# EAGLE design Varmo - Rev A2 (EAGLE 7.6.0)

## Sheet 1 of 3
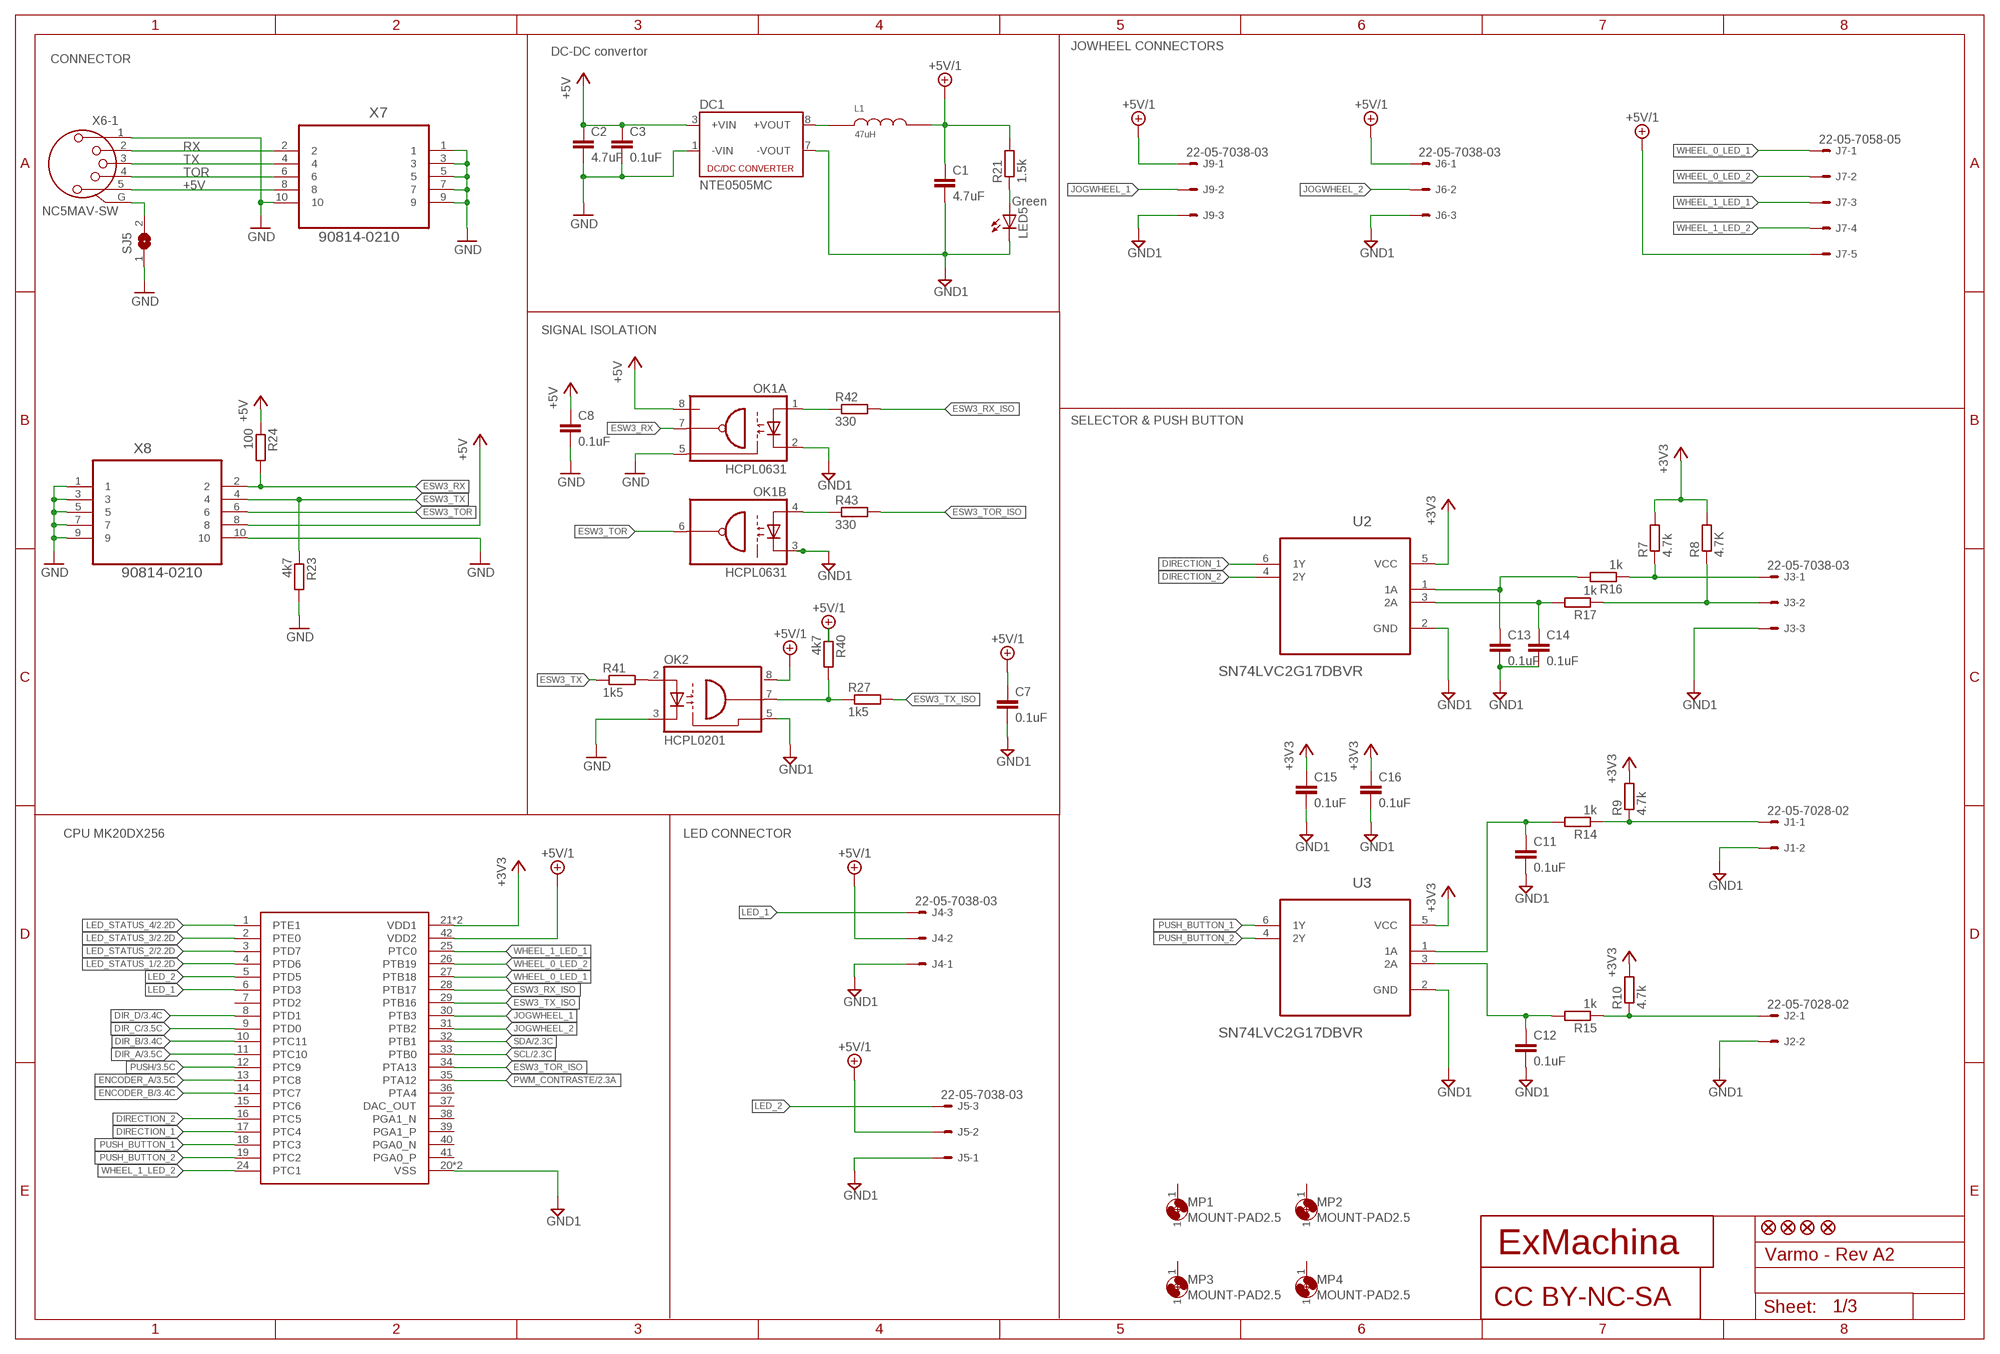
[diagram p0: schematic, sheet 1]

### Parts
C1  4.7uF  C-EUC0603  [C0603]
C2  4.7uF  C-EUC0603  [C0603]
C3  0.1uF  C-EUC0603  [C0603]
C7  0.1uF  C-EUC0603  [C0603]
C8  0.1uF  C-EUC0603  [C0603]
C11  0.1uF  C-EUC0603  [C0603]
C12  0.1uF  C-EUC0603  [C0603]
C13  0.1uF  C-EUC0603  [C0603]
C14  0.1uF  C-EUC0603  [C0603]
C15  0.1uF  C-EUC0603  [C0603]
C16  0.1uF  C-EUC0603  [C0603]
DC1  NTE0505MC  [NTE]
J1  22-05-7028-02  [7395-02]
J2  22-05-7028-02  [7395-02]
J3  22-05-7038-03  [7395-03]
J4  22-05-7038-03  [7395-03]
J5  22-05-7038-03  [7395-03]
J6  22-05-7038-03  [7395-03]
J7  22-05-7058-05  [7395-05]
J9  22-05-7038-03  [7395-03]
JP1  FIDUCIAL1X2  [FIDUCIAL-1X2]
JP2  FIDUCIAL1X2  [FIDUCIAL-1X2]
JP3  FIDUCIAL1X2  [FIDUCIAL-1X2]
JP4  FIDUCIAL1X2  [FIDUCIAL-1X2]
L1  47uH  82473C  [8200]
LED5  Green  LEDCHIP-LED0603  [CHIP-LED0603]
MP1  MOUNT-PAD2.5  [P2.5]
MP2  MOUNT-PAD2.5  [P2.5]
MP3  MOUNT-PAD2.5  [P2.5]
MP4  MOUNT-PAD2.5  [P2.5]
OK1  HCPL0631  [SOIC08]
OK2  HCPL0201  [SOIC08]
R7  4.7k  R-EU_R0603  [R0603]
R8  4.7K  R-EU_R0603  [R0603]
R9  4.7k  R-EU_R0603  [R0603]
R10  4.7k  R-EU_R0603  [R0603]
R14  1k  R-EU_R0603  [R0603]
R15  1k  R-EU_R0603  [R0603]
R16  1k  R-EU_R0603  [R0603]
R17  1k  R-EU_R0603  [R0603]
R21  1.5k  R-EU_R0603  [R0603]
R23  4k7  R-EU_R0603  [R0603]
R24  100  R-EU_R0603  [R0603]
R27  1k5  R-EU_R0603  [R0603]
R40  4k7  R-EU_R0603  [R0603]
R41  1k5  R-EU_R0603  [R0603]
R42  330  R-EU_R0603  [R0603]
R43  330  R-EU_R0603  [R0603]
SJ5  SJ  [SJ]
U2  SN74LVC2G17DBVR  [SOT95P280X145-6N]
U3  SN74LVC2G17DBVR  [SOT95P280X145-6N]
U8  M20DX256  [MK_CUSTOM]
U$1  CC-BY-NC-SA  [CC-BY-NC-SA]
U$6  EXMACHINA-LOGO-NAME  [EXM-LOGO-BASELINE]
X6  NC5MAV-SW  [NC5MAV-SW]
X7  90814-0210  [MOLEX_90814-0210]
X8  90814-0210  [MOLEX_90814-0210]

### Nets
+3V3: C15.1 C16.1 R7.2 R8.2 R9.2 R10.2 U2.5(VCC) U3.5(VCC) U8.21(VDD1) U8.22(VDD1) ; also sheet 2
+5V: C2.1 C3.1 C8.1 DC1.3(+VIN) OK1.8(A:VCC) R24.1 X6.5 X7.8 X8.8
+5V/1: C1.1 C7.1 J4.2 J5.2 J6.1 J7.5 J9.1 L1.2 OK2.8(VCC) R21.2 R40.1 U8.42(VDD2) ; also sheet 2,3
DIR_A: U8.11(PTC10) ; also sheet 3
DIR_B: U8.10(PTC11) ; also sheet 3
DIR_C: U8.9(PTD0) ; also sheet 3
DIR_D: U8.8(PTD1) ; also sheet 3
DIRECTION_1: U2.6(1Y) U8.17(PTC4)
DIRECTION_2: U2.4(2Y) U8.16(PTC5)
ENCODER_A: U8.13(PTC8) ; also sheet 3
ENCODER_B: U8.14(PTC7) ; also sheet 3
ESW3_RX: OK1.7(A:VO) R24.2 X8.2
ESW3_RX_ISO: R42.2 U8.28(PTB17)
ESW3_TOR: OK1.6(B:VO2) X8.6
ESW3_TOR_ISO: R43.2 U8.34(PTA13)
ESW3_TX: R23.1 R41.1 X8.4
ESW3_TX_ISO: R27.2 U8.29(PTB16)
GND: C2.2 C3.2 C8.2 DC1.1(-VIN) OK1.5(A:GND) OK2.3(C) R23.2 SJ5.1 X6.1 X7.1 X7.3 X7.5 X7.7 X7.9 X7.10 X8.1 X8.3 X8.5 X8.7 X8.9 X8.10
GND1: C1.2 C7.2 C11.2 C12.2 C13.2 C14.2 C15.2 C16.2 DC1.7(-VOUT) J1.2 J2.2 J3.3 J4.1 J5.1 J6.3 J9.3 LED5.C OK1.2(A:C1) OK1.3(B:C2) OK2.5(GND) U2.2(GND) U3.2(GND) U8.20(VSS) U8.23(VSS) ; also sheet 2,3
JOGWHEEL_1: J9.2 U8.30(PTB3)
JOGWHEEL_2: J6.2 U8.31(PTB2)
LED_1: J4.3 U8.6(PTD3)
LED_2: J5.3 U8.5(PTD5)
LED_STATUS_1: U8.4(PTD6) ; also sheet 2
LED_STATUS_2: U8.3(PTD7) ; also sheet 2
LED_STATUS_3: U8.2(PTE0) ; also sheet 2
LED_STATUS_4: U8.1(PTE1) ; also sheet 2
N$1: DC1.8(+VOUT) L1.1
N$6: J2.1 R10.1 R15.1
N$7: J1.1 R9.1 R14.1
N$8: J3.1 R7.1 R16.1
N$9: J3.2 R8.1 R17.1
N$10: C13.1 R16.2 U2.1(1A)
N$11: C14.1 R17.2 U2.3(2A)
N$12: C12.1 R15.2 U3.3(2A)
N$13: C11.1 R14.2 U3.1(1A)
N$15: OK2.7(VO) R27.1 R40.2
N$23: SJ5.2 X6.G(-1:G)
N$35: LED5.A R21.1
N$37: OK1.1(A:A1) R42.1
N$38: OK1.4(B:A2) R43.1
N$39: OK2.2(A) R41.2
PUSH: U8.12(PTC9) ; also sheet 3
PUSH_BUTTON_1: U3.6(1Y) U8.18(PTC3)
PUSH_BUTTON_2: U3.4(2Y) U8.19(PTC2)
PWM_CONTRASTE: U8.35(PTA12) ; also sheet 2
RX: X6.2 X7.2
SCL: U8.33(PTB0) ; also sheet 2
SDA: U8.32(PTB1) ; also sheet 2
TOR: X6.4 X7.6
TX: X6.3 X7.4
WHEEL_0_LED_1: J7.1 U8.27(PTB18)
WHEEL_0_LED_2: J7.2 U8.26(PTB19)
WHEEL_1_LED_1: J7.3 U8.25(PTC0)
WHEEL_1_LED_2: J7.4 U8.24(PTC1)
Unconnected: MP1.1 MP2.1 MP3.1 MP4.1 U8.7(PTD2) U8.15(PTC6) U8.36(PTA4) U8.37(DAC_OUT) U8.38(PGA1_N) U8.39(PGA1_P) U8.40(PGA0_N) U8.41(PGA0_P) X6.N(-2:N) X6.NC(-2:NC) X6.NO(-2:NO)

### Notes on the sheet
- JOWHEEL CONNECTORS
- DC-DC convertor
- CONNECTOR
- SIGNAL ISOLATION
- SELECTOR & PUSH BUTTON
- CPU MK20DX256 | LED CONNECTOR

## Sheet 2 of 3: LCD Screen and LED panel
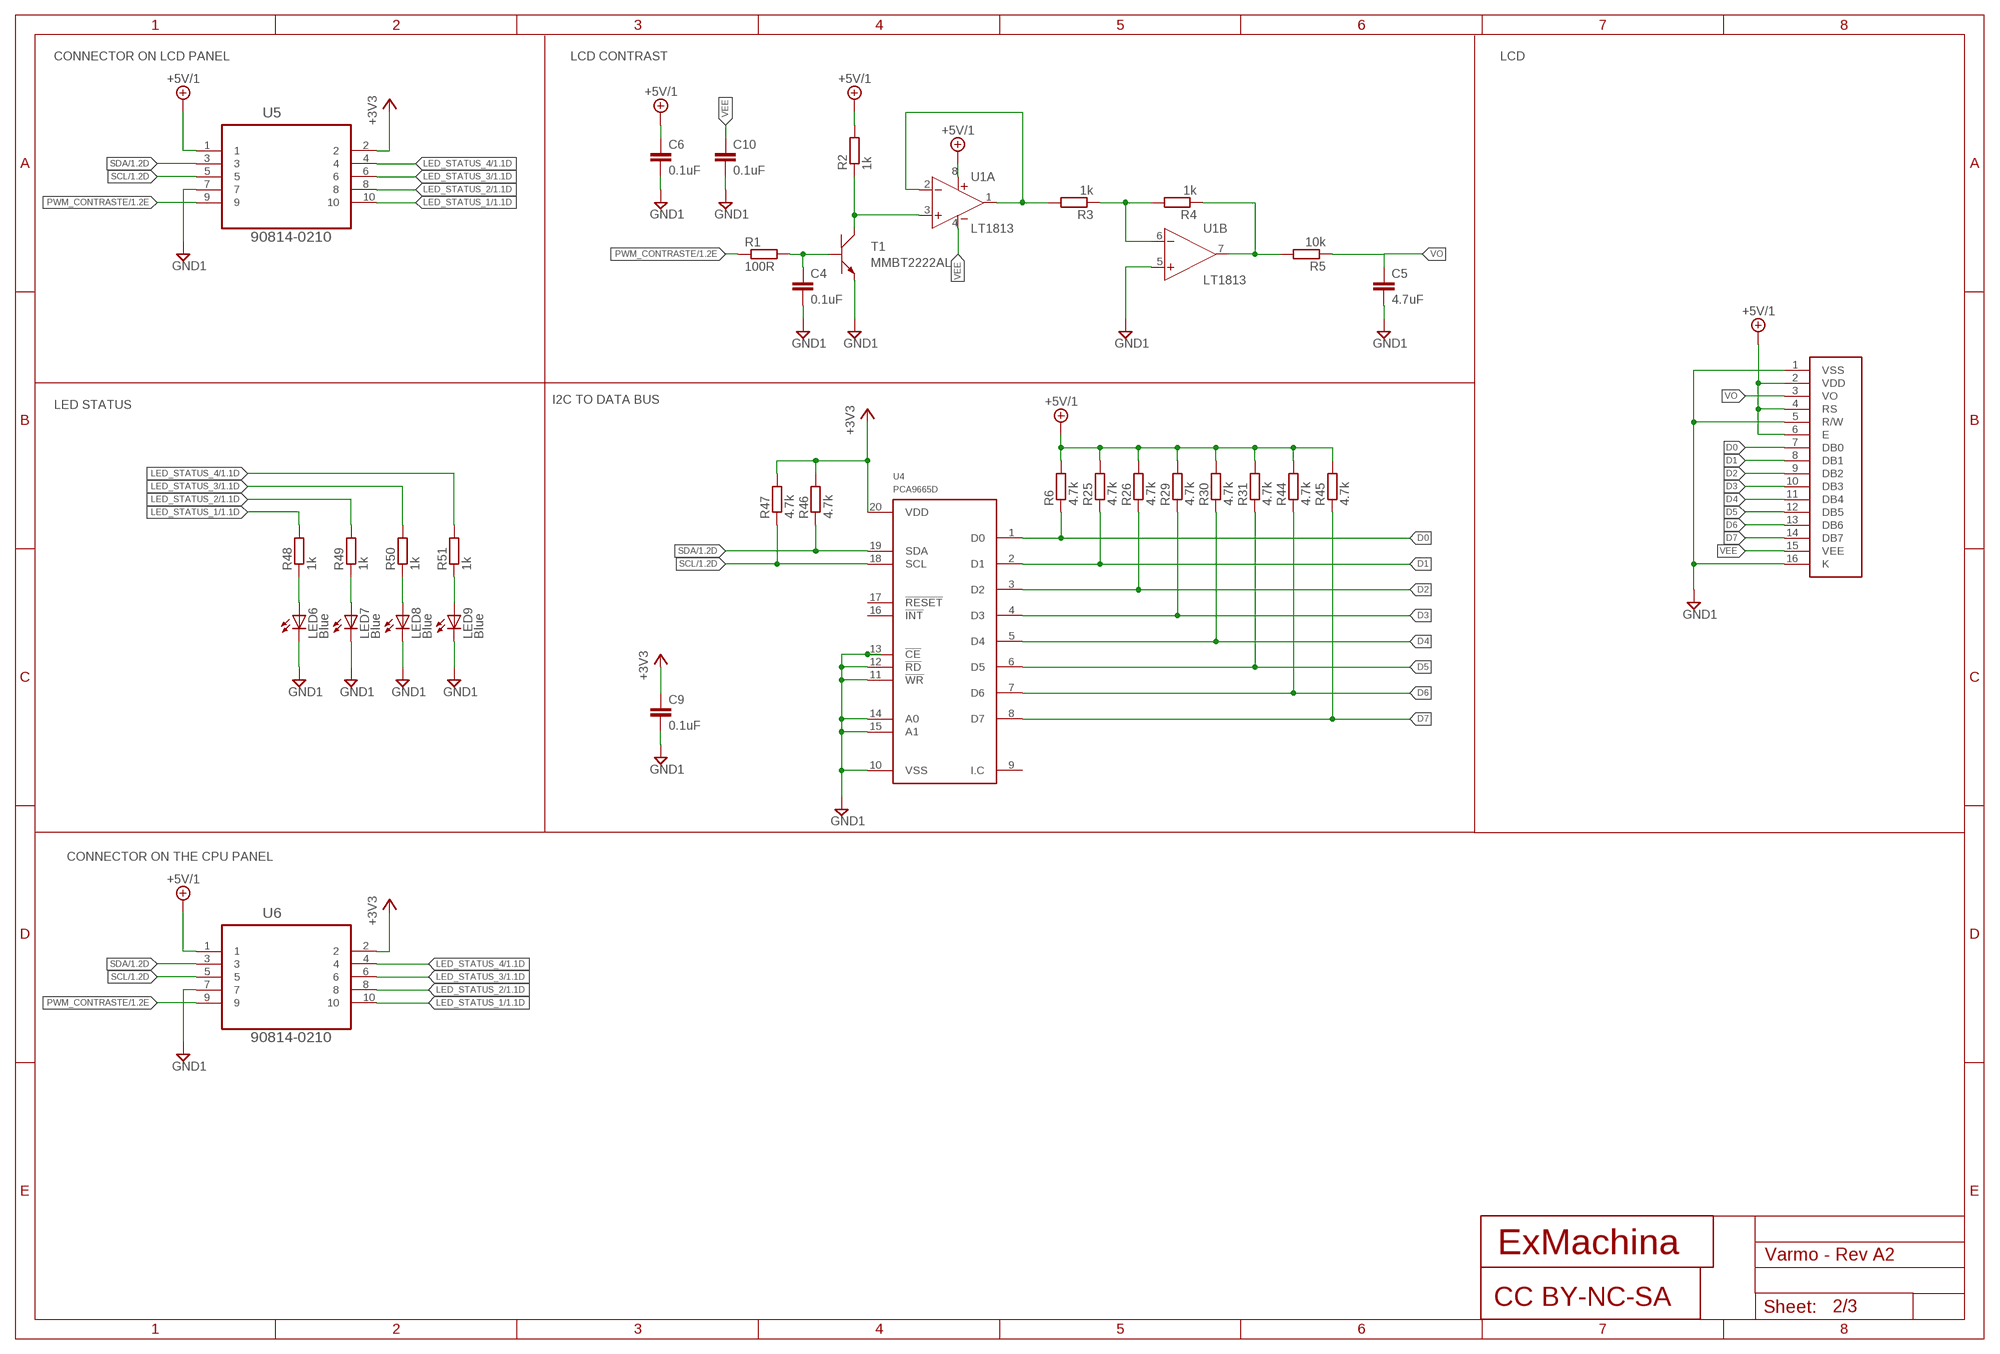
[diagram p1: schematic, sheet 2]

### Parts
C4  0.1uF  C-EUC0603  [C0603]
C5  4.7uF  C-EUC0603  [C0603]
C6  0.1uF  C-EUC0603  [C0603]
C9  0.1uF  C-EUC0603  [C0603]
C10  0.1uF  C-EUC0603  [C0603]
LCD1  MC41605A12W  [CONNECTOR]
LED6  Blue  LEDCHIP-LED0603  [CHIP-LED0603]
LED7  Blue  LEDCHIP-LED0603  [CHIP-LED0603]
LED8  Blue  LEDCHIP-LED0603  [CHIP-LED0603]
LED9  Blue  LEDCHIP-LED0603  [CHIP-LED0603]
R1  100R  R-EU_R0603  [R0603]
R2  1k  R-EU_R0603  [R0603]
R3  1k  R-EU_R0603  [R0603]
R4  1k  R-EU_R0603  [R0603]
R5  10k  R-EU_R0603  [R0603]
R6  4.7k  R-EU_R0603  [R0603]
R25  4.7k  R-EU_R0603  [R0603]
R26  4.7k  R-EU_R0603  [R0603]
R29  4.7k  R-EU_R0603  [R0603]
R30  4.7k  R-EU_R0603  [R0603]
R31  4.7k  R-EU_R0603  [R0603]
R44  4.7k  R-EU_R0603  [R0603]
R45  4.7k  R-EU_R0603  [R0603]
R46  4.7k  R-EU_R0603  [R0603]
R47  4.7k  R-EU_R0603  [R0603]
R48  1k  R-EU_R0603  [R0603]
R49  1k  R-EU_R0603  [R0603]
R50  1k  R-EU_R0603  [R0603]
R51  1k  R-EU_R0603  [R0603]
T1  MMBT2222AL  [SOT−23]
U1  LT1813  [S8]
U4  PCA9665D  [SOT163-1]
U5  90814-0210  [MOLEX_90814-0210]
U6  90814-0210  [MOLEX_90814-0210]
U$5  CC-BY-NC-SA  [CC-BY-NC-SA]
U$7  EXMACHINA-LOGO-NAME  [EXM-LOGO-BASELINE]

### Nets
+3V3: C9.1 R46.2 R47.2 U4.20(VDD) U5.2 U6.2 ; also sheet 1
+5V/1: C6.1 LCD1.2(VDD) LCD1.4(RS) LCD1.6(E) R2.2 R6.2 R25.2 R26.2 R29.2 R30.2 R31.2 R44.2 R45.2 U1.8(A:V+) U5.1 U6.1 ; also sheet 1,3
D0: LCD1.7(DB0) R6.1 U4.1(D0)
D1: LCD1.8(DB1) R25.1 U4.2(D1)
D2: LCD1.9(DB2) R26.1 U4.3(D2)
D3: LCD1.10(DB3) R29.1 U4.4(D3)
D4: LCD1.11(DB4) R30.1 U4.5(D4)
D5: LCD1.12(DB5) R31.1 U4.6(D5)
D6: LCD1.13(DB6) R44.1 U4.7(D6)
D7: LCD1.14(DB7) R45.1 U4.8(D7)
GND1: C4.2 C5.2 C6.2 C9.2 C10.2 LCD1.1(VSS) LCD1.5(R/W) LCD1.16(K) LED6.C LED7.C LED8.C LED9.C T1.2(E) U1.5(B:IN+) U4.10(VSS) U4.11(!WR) U4.12(!RD) U4.13(!CE) U4.14(A0) U4.15(A1) U5.7 U6.7 ; also sheet 1,3
LED_STATUS_1: R48.2 U5.10 U6.10 ; also sheet 1
LED_STATUS_2: R49.2 U5.8 U6.8 ; also sheet 1
LED_STATUS_3: R50.2 U5.6 U6.6 ; also sheet 1
LED_STATUS_4: R51.2 U5.4 U6.4 ; also sheet 1
N$2: C4.1 R1.2 T1.1(B)
N$3: R2.1 T1.3(C) U1.3(A:IN+)
N$4: LED6.A R48.1
N$5: R3.2 U1.1(A:OUT) U1.2(A:IN-)
N$14: R3.1 R4.2 U1.6(B:IN-)
N$17: R4.1 R5.2 U1.7(B:OUT)
N$22: LED7.A R49.1
N$24: LED8.A R50.1
N$29: LED9.A R51.1
PWM_CONTRASTE: R1.1 U5.9 U6.9 ; also sheet 1
SCL: R47.1 U4.18(SCL) U5.5 U6.5 ; also sheet 1
SDA: R46.1 U4.19(SDA) U5.3 U6.3 ; also sheet 1
VEE: C10.1 LCD1.15(VEE) U1.4(A:V-)
VO: C5.1 LCD1.3(VO) R5.1
Unconnected: U4.9(I.C) U4.16(!INT) U4.17(!RESET)

### Notes on the sheet
- CONNECTOR ON LCD PANEL | LCD CONTRAST | LCD
- I2C TO DATA BUS
- LED STATUS
- CONNECTOR ON THE CPU PANEL

## Sheet 3 of 3: ENCODER AND JOYSTICK
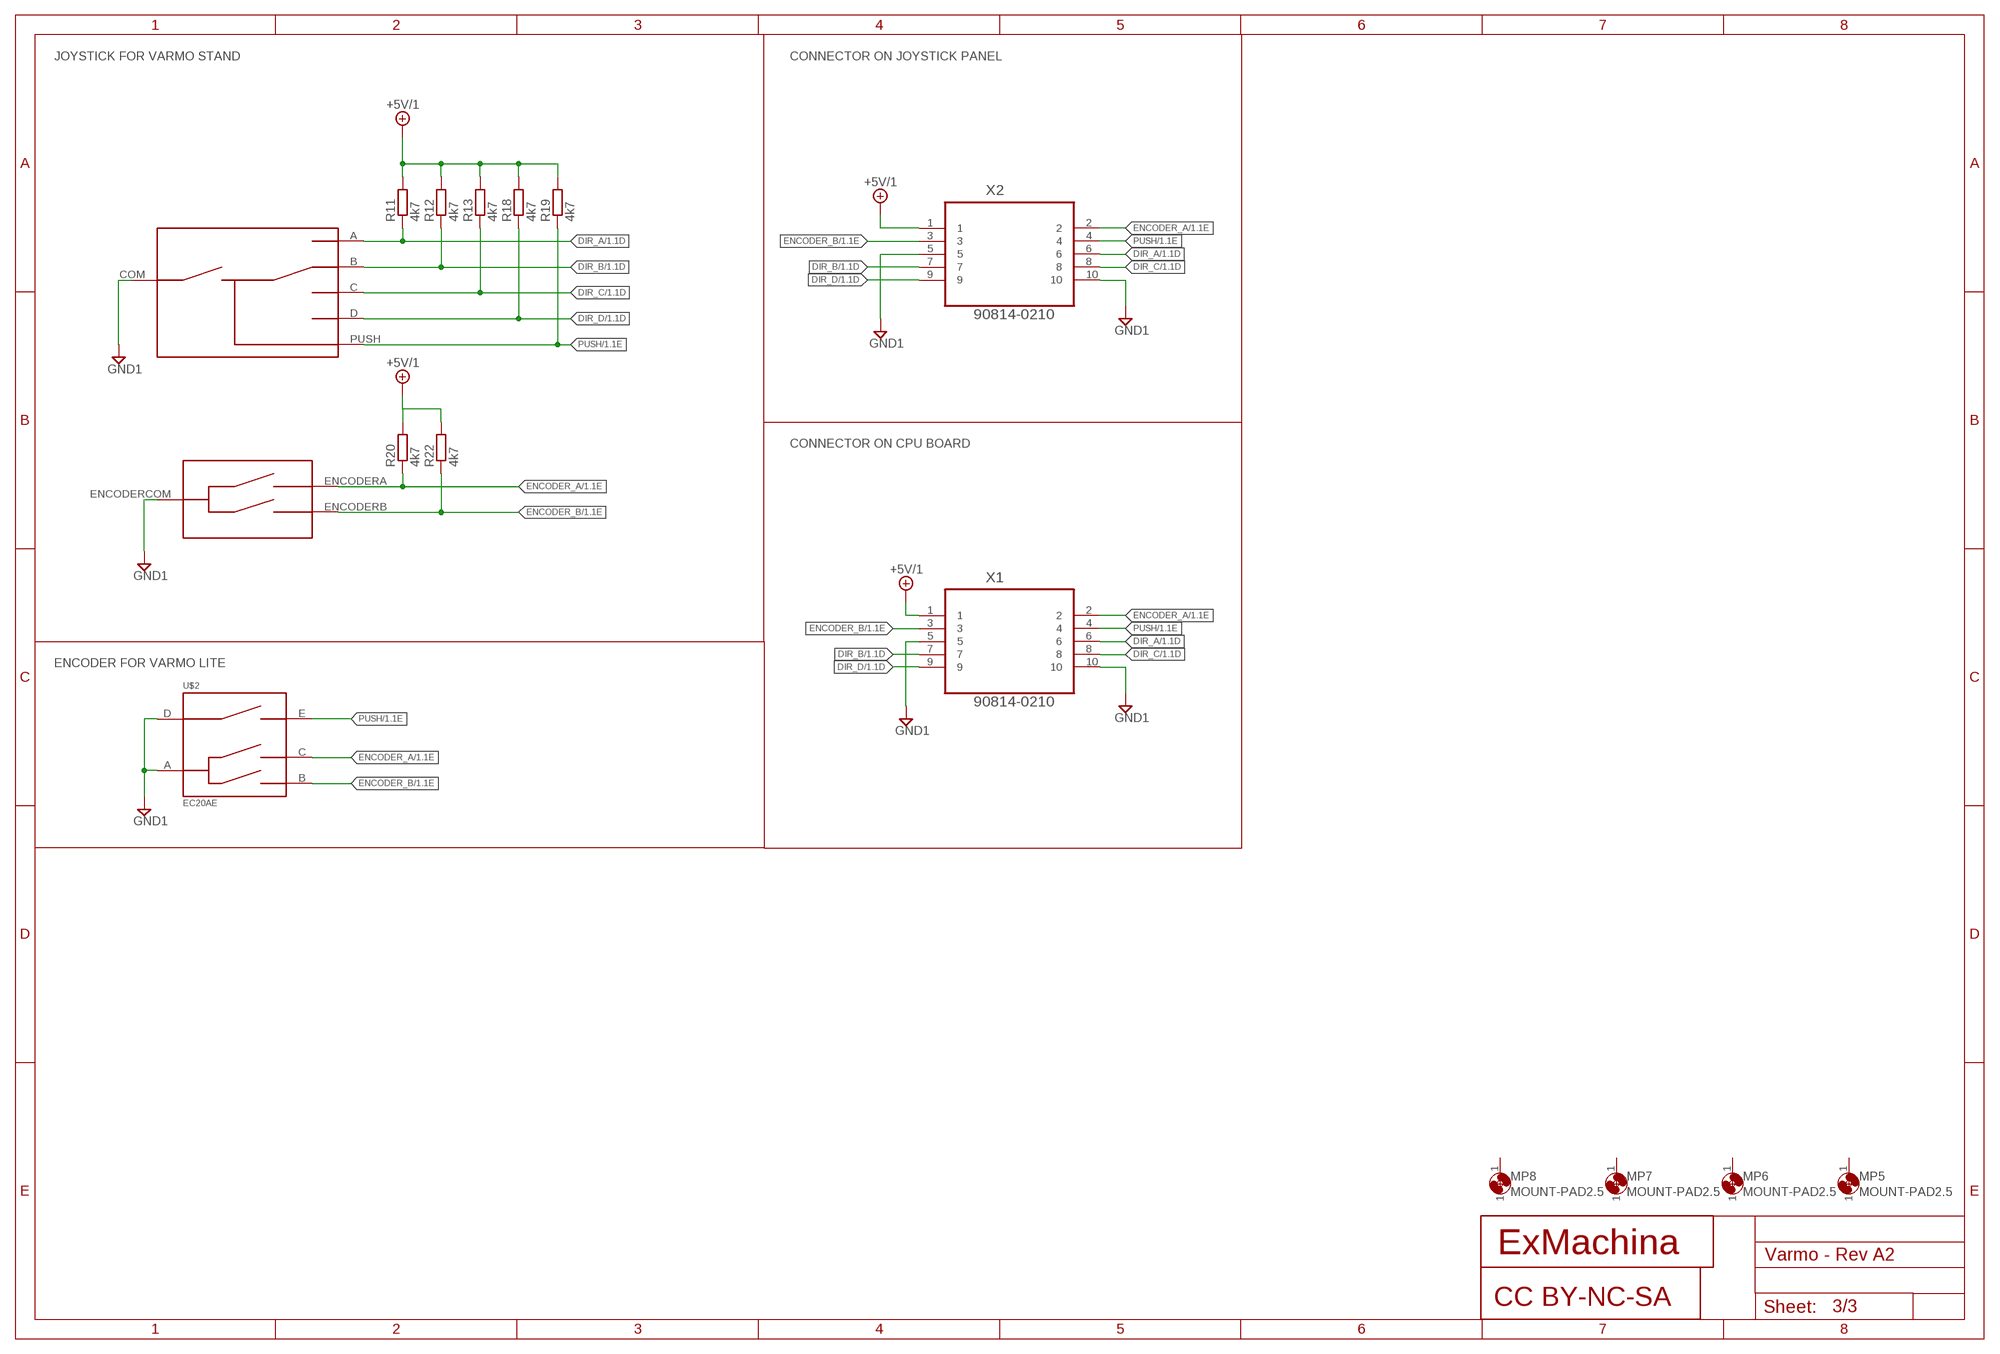
[diagram p2: schematic, sheet 3]

### Parts
ENC1  RKJXTF42001  [RKJXT1F]
MP5  MOUNT-PAD2.5  [P2.5]
MP6  MOUNT-PAD2.5  [P2.5]
MP7  MOUNT-PAD2.5  [P2.5]
MP8  MOUNT-PAD2.5  [P2.5]
R11  4k7  R-EU_R0603  [R0603]
R12  4k7  R-EU_R0603  [R0603]
R13  4k7  R-EU_R0603  [R0603]
R18  4k7  R-EU_R0603  [R0603]
R19  4k7  R-EU_R0603  [R0603]
R20  4k7  R-EU_R0603  [R0603]
R22  4k7  R-EU_R0603  [R0603]
U$2  EC20AE  [EC20A]
U$3  EXMACHINA-LOGO-NAME  [EXM-LOGO-BASELINE]
U$4  CC-BY-NC-SA  [CC-BY-NC-SA]
X1  90814-0210  [MOLEX_90814-0210]
X2  90814-0210  [MOLEX_90814-0210]

### Nets
+5V/1: R11.2 R12.2 R13.2 R18.2 R19.2 R20.2 R22.2 X1.1 X2.1 ; also sheet 1,2
DIR_A: ENC1.A R11.1 X1.6 X2.6 ; also sheet 1
DIR_B: ENC1.B R12.1 X1.7 X2.7 ; also sheet 1
DIR_C: ENC1.C R13.1 X1.8 X2.8 ; also sheet 1
DIR_D: ENC1.D R18.1 X1.9 X2.9 ; also sheet 1
ENCODER_A: ENC1.ENCODERA(A) R20.1 U$2.C(ENCODER_A) X1.2 X2.2 ; also sheet 1
ENCODER_B: ENC1.ENCODERB(B) R22.1 U$2.B(ENCODER_B) X1.3 X2.3 ; also sheet 1
GND1: ENC1.COM ENC1.ENCODERCOM(COM) U$2.A(COM) U$2.D(COM_PUSH) X1.5 X1.10 X2.5 X2.10 ; also sheet 1,2
PUSH: ENC1.PUSH R19.1 U$2.E(PUSH) X1.4 X2.4 ; also sheet 1
Unconnected: MP5.1 MP6.1 MP7.1 MP8.1

### Notes on the sheet
- JOYSTICK FOR VARMO STAND | CONNECTOR ON JOYSTICK PANEL
- CONNECTOR ON CPU BOARD
- ENCODER FOR VARMO LITE

## Library data of the parts
C1 C2 = rcl:C-EU: CAPACITOR, European symbol; MPN: MC0603X475K100CT; OC_NEWARK: 06X6198
C3 C7 C8 C11-C16 = rcl:C-EU: CAPACITOR, European symbol; MPN: MC0603B104K160CT; OC_NEWARK: 06R4923
C4-C6 C9 C10 = rcl:C-EU: CAPACITOR, European symbol
DC1 = dc-dc-converter:NTE; MF: C & D TECHNOLOGIES, INC; MPN: NTE0505MC; OC_NEWARK: 61K3399
ENC1 = encoder:RKJXTF: 4-directional Stick Switch (with Encoder + Center-push Function)
J1 J2 = con-molex:22-?-02: CONNECTOR wire to board 2.54 mm (.1 inch) pitch header; OC_FARNELL: 9731601; OC_NEWARK: unknown
J3-J6 J9 = con-molex:22-?-03: CONNECTOR wire to board 2.54 mm (.1 inch) pitch header; OC_FARNELL: unknown; OC_NEWARK: unknown
J7 = con-molex:22-?-05: CONNECTOR wire to board 2.54 mm (.1 inch) pitch header; OC_FARNELL: unknown; OC_NEWARK: unknown
JP1-JP4 = SparkFun:FIDUCIAL: Fiducial Alignment Points Various fiducial points for machine vision alignment.
L1 = murata-inductance:82473C; MPN: 82473C; OC_NEWARK: 40M7122
LCD1 = midas:MC41605A12W
LED5 = led:LED: LED OSRAM: - CHIPLED LG R971, LG N971, LY N971, LG Q971, LY Q971, LO R971, LY R971 LH N974, LH R974 LS Q976, LO Q976, LY Q976 LO Q996 - Hyper CHIPLED LW Q18S LB Q993, LB Q99A, LB R99A - SideLED LS A670, LO A670, LY A670, LG A670, LP A670 LB A673, LV A673, LT A673, LW A673 LH A674 LY A675 LS A676, LA A676, LO A676, LY A676, LW A676 LS A679, LY A679, LG A679 - Hyper Micro SIDELED® LS Y876, LA Y876, LO Y876, LY Y876 LT Y87S - SmartLED LW L88C, LW L88S LB L89C, LB L89S, LG L890 LS L89K, LO L89K, LY L89K LS L896, LA L896, LO L896, LY L896 - TOPLED LS T670, LO T670, LY T670, LG T670, LP T670 LSG T670, LSP T670, LSY T670, LOP T670, LYG T670 LG T671, LOG T671, LSG T671 LB T673, LV T673, LT T673, LW T673 LH T674 LS T676, LA T676, LO T676, LY T676, LB T676, LH T676, LSB T676, LW T676 LB T67C, LV T67C, LT T67C, LS T67K, LO T67K, LY T67K, LW E67C LS E67B, LA E67B, LO E67B, LY E67B, LB E67C, LV E67C, LT E67C LW T67C LS T679, LY T679, LG T679 LS T770, LO T770, LY T770, LG T770, LP T770 LB T773, LV T773, LT T773, LW T773 LH T774 LS E675, LA E675, LY E675, LS T675 LS T776, LA T776, LO T776, LY T776, LB T776 LHGB T686 LT T68C, LB T68C - Hyper Mini TOPLED® LB M676 - Mini TOPLED Santana® LG M470 LS M47K, LO M47K, LY M47K Source: http://www.osram.convergy.de LUXEON: - LUMILED® LXK2-PW12-R00, LXK2-PW12-S00, LXK2-PW14-U00, LXK2-PW14-V00 LXK2-PM12-R00, LXK2-PM12-S00, LXK2-PM14-U00 LXK2-PE12-Q00, LXK2-PE12-R00, LXK2-PE12-S00, LXK2-PE14-T00, LXK2-PE14-U00 LXK2-PB12-K00, LXK2-PB12-L00, LXK2-PB12-M00, LXK2-PB14-N00, LXK2-PB14-P00, LXK2-PB14-Q00 LXK2-PR12-L00, LXK2-PR12-M00, LXK2-PR14-Q00, LXK2-PR14-R00 LXK2-PD12-Q00, LXK2-PD12-R00, LXK2-PD12-S00 LXK2-PH12-R00, LXK2-PH12-S00 LXK2-PL12-P00, LXK2-PL12-Q00, LXK2-PL12-R00 Source: www.luxeon.com KINGBRIGHT: KA-3528ASYC Source: www.kingbright.com; MPN: OVS-0604; OC_NEWARK: 15R2206
LED6-LED9 = led:LED: LED OSRAM: - CHIPLED LG R971, LG N971, LY N971, LG Q971, LY Q971, LO R971, LY R971 LH N974, LH R974 LS Q976, LO Q976, LY Q976 LO Q996 - Hyper CHIPLED LW Q18S LB Q993, LB Q99A, LB R99A - SideLED LS A670, LO A670, LY A670, LG A670, LP A670 LB A673, LV A673, LT A673, LW A673 LH A674 LY A675 LS A676, LA A676, LO A676, LY A676, LW A676 LS A679, LY A679, LG A679 - Hyper Micro SIDELED® LS Y876, LA Y876, LO Y876, LY Y876 LT Y87S - SmartLED LW L88C, LW L88S LB L89C, LB L89S, LG L890 LS L89K, LO L89K, LY L89K LS L896, LA L896, LO L896, LY L896 - TOPLED LS T670, LO T670, LY T670, LG T670, LP T670 LSG T670, LSP T670, LSY T670, LOP T670, LYG T670 LG T671, LOG T671, LSG T671 LB T673, LV T673, LT T673, LW T673 LH T674 LS T676, LA T676, LO T676, LY T676, LB T676, LH T676, LSB T676, LW T676 LB T67C, LV T67C, LT T67C, LS T67K, LO T67K, LY T67K, LW E67C LS E67B, LA E67B, LO E67B, LY E67B, LB E67C, LV E67C, LT E67C LW T67C LS T679, LY T679, LG T679 LS T770, LO T770, LY T770, LG T770, LP T770 LB T773, LV T773, LT T773, LW T773 LH T774 LS E675, LA E675, LY E675, LS T675 LS T776, LA T776, LO T776, LY T776, LB T776 LHGB T686 LT T68C, LB T68C - Hyper Mini TOPLED® LB M676 - Mini TOPLED Santana® LG M470 LS M47K, LO M47K, LY M47K Source: http://www.osram.convergy.de LUXEON: - LUMILED® LXK2-PW12-R00, LXK2-PW12-S00, LXK2-PW14-U00, LXK2-PW14-V00 LXK2-PM12-R00, LXK2-PM12-S00, LXK2-PM14-U00 LXK2-PE12-Q00, LXK2-PE12-R00, LXK2-PE12-S00, LXK2-PE14-T00, LXK2-PE14-U00 LXK2-PB12-K00, LXK2-PB12-L00, LXK2-PB12-M00, LXK2-PB14-N00, LXK2-PB14-P00, LXK2-PB14-Q00 LXK2-PR12-L00, LXK2-PR12-M00, LXK2-PR14-Q00, LXK2-PR14-R00 LXK2-PD12-Q00, LXK2-PD12-R00, LXK2-PD12-S00 LXK2-PH12-R00, LXK2-PH12-S00 LXK2-PL12-P00, LXK2-PL12-Q00, LXK2-PL12-R00 Source: www.luxeon.com KINGBRIGHT: KA-3528ASYC Source: www.kingbright.com
MP1-MP8 = holes:MOUNT-PAD: MOUNTING HOLE with drill center marker
OK1 = optocoupler:HCPL0631
OK2 = optocoupler:HCPL0201
R1-R6 R25 R26 R29-R31 R44-R51 = rcl:R-EU_: RESISTOR, European symbol
R7-R10 R14-R17 = rcl:R-EU_: RESISTOR, European symbol; MPN: MCMR06X4701FTL; OC_NEWARK: 86T3649
R11-R13 R18-R20 R22-R24 R27 R40-R43 = rcl:R-EU_: RESISTOR, European symbol; MPN: MCMR06X000 PTL; OC_NEWARK: 86T3500
R21 = rcl:R-EU_: RESISTOR, European symbol; MPN: MCMR06X1501FTL; OC_NEWARK: 86T3542
SJ5 = jumper:SJ: SMD solder JUMPER; OC_NEWARK: unknown
T1 = transistor:MMBT2222AL: General Purpose Transistors
U1 = lineartechnology:LT1813: Dual AOP 3mA, 100MHz, 750V/us
U2 U3 = ti:SN74LVC2G17DBVR: DUAL SCHMITT-TRIGGER BUFFER; MF: TEXAS INSTRUMENTS; MPN: SN74LVC2G17DBVR; OC_FARNELL: 1470776; OC_NEWARK: 76C4207; PACKAGE: SOT-23-6; SUPPLIER: Texas Instruments
U4 = NXP:PCA9665D
U5 U6 X1 X2 X7 X8 = Molex_By_element14_Batch_1:90814-0210: CONN HEADER 10POS 1.27MM SMD TIN; MPN: 90814-0210; OC_FARNELL: 1757026; OC_NEWARK: 34R6217; PACKAGE: CONN-10POS; SUPPLIER: Molex
U8 = custom:M20DX256
U$1 U$4 U$5 = cc-by-sa:CC-BY-NC-SA
U$2 = encoder:EC20A
U$3 U$6 U$7 = exmachina:EXMACHINA-LOGO
X6 = con-neutrik_ag:NC5?-SW: Neutrik Audio Connector XLR SERIES Stereo 1/4" jack Source: www.neutrik.com/; MPN: NC5MAV-SW; OC_FARNELL: unknown; OC_NEWARK: 31M5714

## Net classes
0 default: width 0.178 mm, drill 0.35 mm
1 power: width 0.406 mm, drill 0.013 mm

## Board
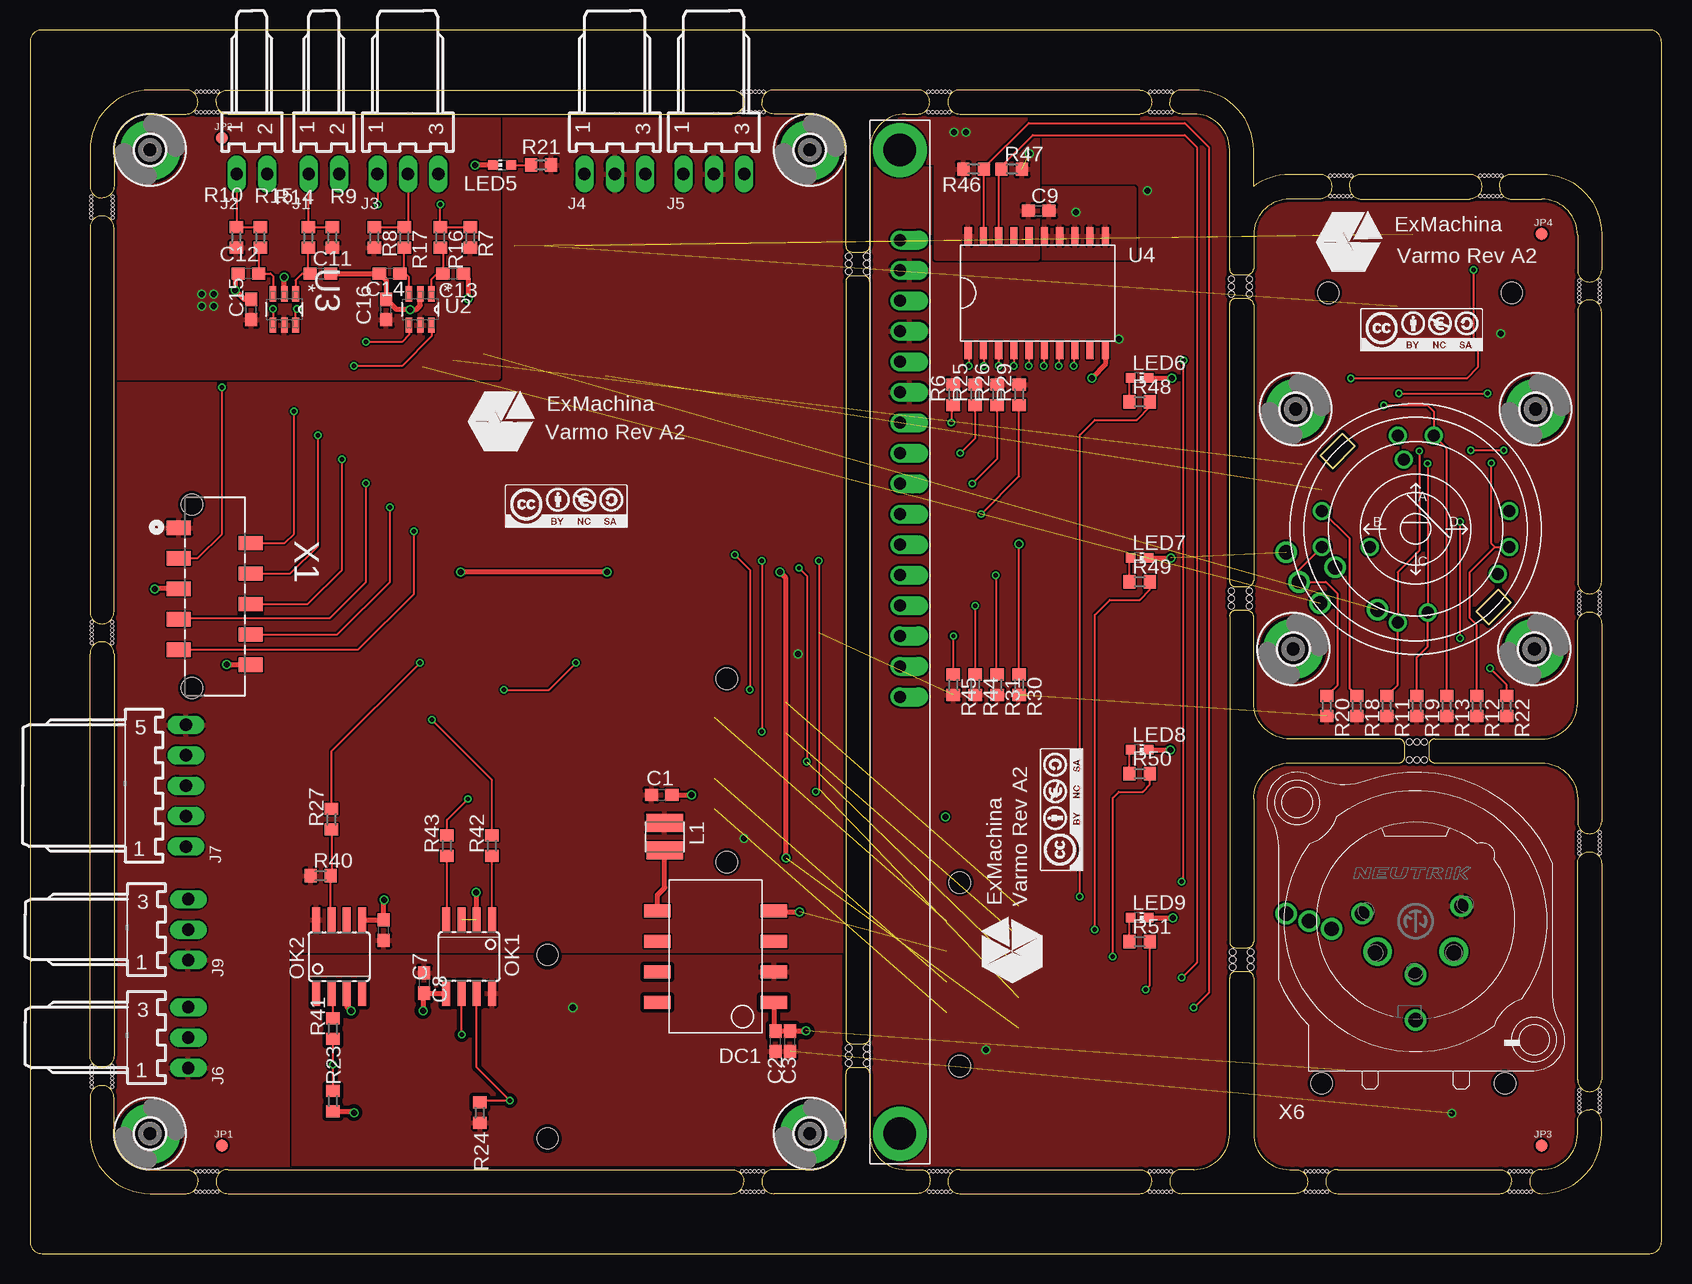
[diagram p3: board, top side]
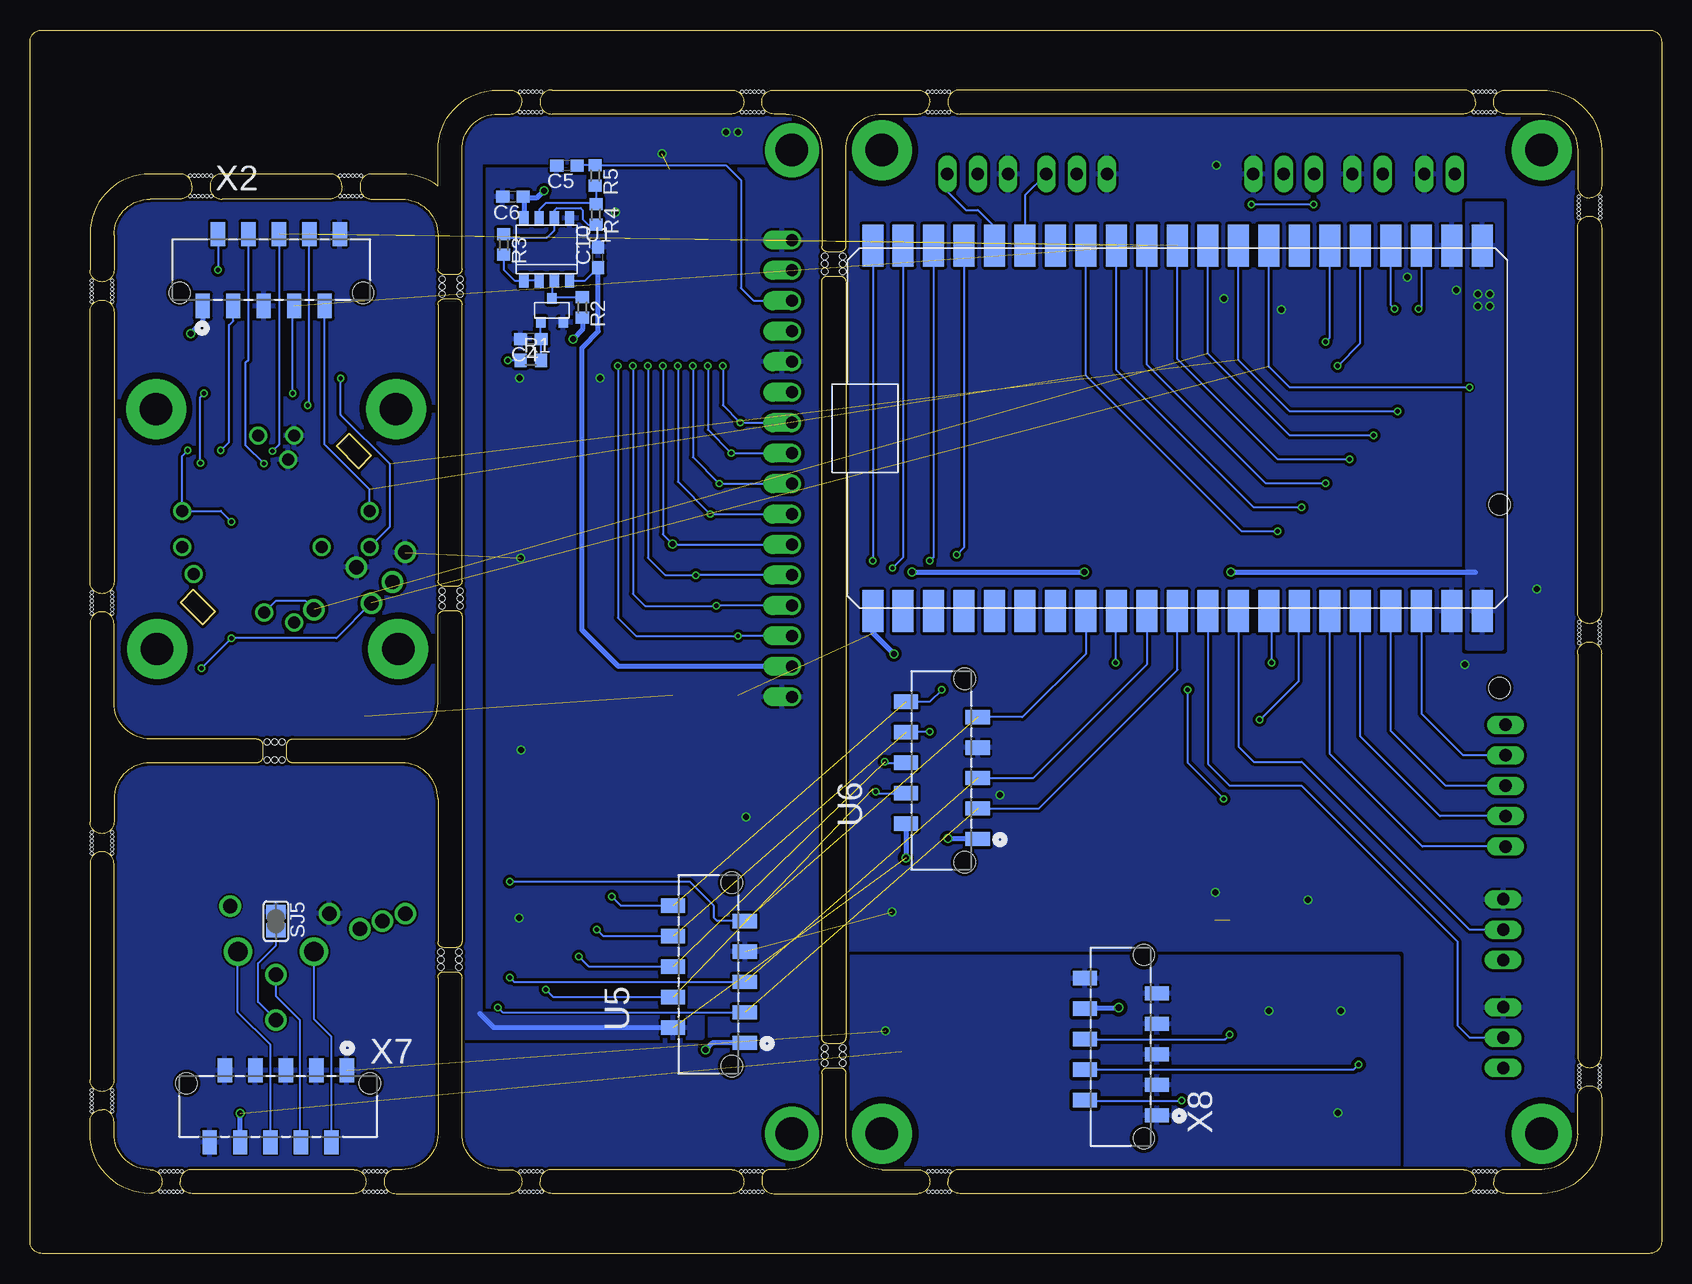
[diagram p4: board, bottom side, seen from below]

Size 136 x 102 mm. Coordinates in mm from the lower left corner, seen from the top.
Outline: 68,84 68,92 arc90 65,95 62,95 arc-90 61,96 arc-90 62,97 74,97 arc-90 75,96 arc-90 74,95 73,95 arc90 70,92 70,84 arc-90 69.5,83.5 68.5,83.5 arc-90 68,84
Outline: 59.5,96 arc-90 58.5,95 16.5,95 arc-90 15.5,96 arc-90 16.5,97 58.5,97 arc-90 59.5,96
Outline: 10,95 13,95 arc90 14,96 arc90 13,97 10,97 arc90 5,92 5,89 arc90 6,88 arc90 7,89 7,92 arc-90 10,95
Outline: 5,85.5 5,53.5 arc90 6,52.5 arc90 7,53.5 7,85.5 arc90 6,86.5 arc90 5,85.5
Outline: 7,50 7,16.5 arc-90 6,15.5 arc-90 5,16.5 5,50 arc-90 6,51 arc-90 7,50
Outline: 7,10 7,13 arc90 6,14 arc90 5,13 5,10 arc90 10,5 13,5 arc90 14,6 arc90 13,7 10,7 arc-90 7,10
Outline: 16.5,7 58.5,7 arc-90 59.5,6 arc-90 58.5,5 16.5,5 arc-90 15.5,6 arc-90 16.5,7
Outline: 65,7 62,7 arc90 61,6 arc90 62,5 74,5 arc90 75,6 75,6.29 arc90 74.29,7 73,7 arc-90 70,10 70,15 arc90 69.5,15.5 68.5,15.5 arc90 68,15 68,10 arc-90 65,7
Outline: 77.5,7 92.5,7 arc-90 93.5,6 arc-90 92.5,5 77.5,5 arc-90 76.5,6 arc-90 77.5,7
Outline: 97,7 96,7 arc90 95,6 arc90 96,5 105.5,5 arc90 106.5,6 arc90 105.5,7 105,7 arc-90 102,10 102,23 arc90 101.5,23.5 100.5,23.5 arc90 100,23 100,10 arc-90 97,7
Outline: 68,18 arc90 68.5,17.5 69.5,17.5 arc90 70,18 70,81 arc90 69.5,81.5 68.5,81.5 arc90 68,81 68,18
Outline: 100,82.1 100,92 arc90 97,95 96,95 arc-90 95,96 arc-90 96,97 97,97 arc-90 102,92 102,89 arc-37 105,90 107.5,90 arc-90 108.5,89 108.5,88.9 arc-90 107.5,87.9 105,87.9 arc90 102,84.9 102,82.1 arc-90 101.4,81.6 100.4,81.6 arc-90 100,82.1
Outline: 93.5,96 arc-90 92.5,95 77.5,95 arc-90 76.5,96 arc-90 77.5,97 92.5,97 arc-90 93.5,96
Outline: 109,7 122.5,7 arc-90 123.5,6 arc-90 122.5,5 109,5 arc-90 108,6 arc-90 109,7
Outline: 126,7 arc90 125,6 arc90 126,5 arc90 131,10 131,11 arc90 130,12 arc90 129,11 129,10 arc-90 126,7
Outline: 117.1,40.9 126,40.9 arc-90 129,37.9 129,36 arc90 130,35 arc90 131,36 131,52.5 arc90 130,53.5 arc90 129,52.5 129,45.9 arc-90 126,42.9 117.1,42.9 arc90 116.6,42.4 116.6,41.4 arc90 117.1,40.9
Outline: 129,14.5 129,32.5 arc-90 130,33.5 arc-90 131,32.5 131,14.5 arc-90 130,13.5 arc-90 129,14.5
Outline: 100,26 arc90 100.5,25.5 101.5,25.5 arc90 102,26 102,37.9 arc-90 105,40.9 114.1,40.9 arc90 114.6,41.4 114.6,42.4 arc90 114.1,42.9 105,42.9 arc-90 102,45.9 102,53.1 arc90 101.4,53.6 100.4,53.6 arc90 100,53.1 100,26
Outline: 131,56 131,78.5 arc90 130,79.5 arc90 129,78.5 129,56 arc90 130,55 arc90 131,56
Outline: 129,84.9 129,82 arc90 130,81 arc90 131,82 131,85 arc90 126,90 123.5,90 arc90 122.5,89 122.5,88.9 arc90 123.5,87.9 126,87.9 arc-90 129,84.9
Outline: 110,88.9 110,89 arc-90 111,90 120,90 arc-90 121,89 121,88.9 arc-90 120,87.9 111,87.9 arc-90 110,88.9
Outline: 102,79.1 arc90 101.4,79.6 100.4,79.6 arc90 100,79.1 100,56.1 arc90 100.4,55.6 101.4,55.6 arc90 102,56.1 102,79.1
Outline: 0,101 0,1 arc90 1,0 135,0 arc90 136,1 136,101 arc90 135,102 1,102 arc90 0,101
Copper layers (1*16): Top 0.018mm / dielectric 1.55mm / Bottom 0.018mm
Design rules "eC_2Layer_PClass6_BaseCopperO18_eCDefault *": minimum track width 7mil, minimum drill 0.35mm, track to track 0.15mm, track to pad 0.15mm, pad to pad 0.15mm, via to via 0.15mm, smd to smd 0mil, copper to edge 0.25mm, drill to drill 0.35mm, minimum pad ring 0.175mm, minimum via ring 0.125mm, stop-mask expansion 0mil, vias tented up to drill 0.45mm, thermal gap 0.2mm
Holes 0.5 mm at 69.75,15.88 69.75,17.12 69.75,16.5 68.25,15.88 68.25,16.5 68.25,17.12 69.75,81.88 69.75,83.12 69.75,82.5 68.25,81.88 68.25,82.5 68.25,83.12 101.75,23.88 101.75,25.12 101.75,24.5 100.25,23.88 100.25,24.5 100.25,25.12 101.65,79.97 101.65,81.22 101.65,80.6 100.15,79.97 100.15,80.6 100.15,81.22 116.22,42.65 114.97,42.65 115.6,42.65 116.22,41.15 115.6,41.15 114.97,41.15 101.65,53.98 101.65,55.23 101.65,54.6 100.15,53.98 100.15,54.6 100.15,55.23
Holes 0.25 mm at 5.1,87.05 5.1,86.7 5.1,86.35 5.1,87.4 5.1,87.75 5.1,88.1 6.9,87.05 6.9,86.7 6.9,86.35 6.9,87.4 6.9,87.75 6.9,88.1 5.15,51.6 5.15,51.25 5.15,50.9 5.15,51.95 5.15,52.3 5.15,52.65 6.85,51.6 6.85,51.25 6.85,50.9 6.85,51.95 6.85,52.3 6.85,52.65 5.15,14.6 5.15,14.25 5.15,13.9 5.15,14.95 5.15,15.3 5.15,15.65 6.85,14.6 6.85,14.25 6.85,13.9 6.85,14.95 6.85,15.3 6.85,15.65 14.9,5.15 15.25,5.15 15.6,5.15 14.55,5.15 14.2,5.15 13.85,5.15 14.9,6.85 15.25,6.85 15.6,6.85 14.55,6.85 14.2,6.85 13.85,6.85 60.4,5.15 60.75,5.15 61.1,5.15 60.05,5.15 59.7,5.15 59.35,5.15 60.4,6.85 60.75,6.85 61.1,6.85 60.05,6.85 59.7,6.85 59.35,6.85 76,5.15 76.35,5.15 76.7,5.15 75.65,5.15 75.3,5.15 74.95,5.15 76,6.85 76.35,6.85 76.7,6.85 75.65,6.85 75.3,6.85 74.95,6.85 94.4,5.15 94.75,5.15 95.1,5.15 94.05,5.15 93.7,5.15 93.35,5.15 94.4,6.85 94.75,6.85 95.1,6.85 94.05,6.85 93.7,6.85 93.35,6.85 107.4,5.15 107.75,5.15 108.1,5.15 107.05,5.15 106.7,5.15 106.35,5.15 107.4,6.85 107.75,6.85 108.1,6.85 107.05,6.85 106.7,6.85 106.35,6.85 124.4,5.15 124.75,5.15 125.1,5.15 124.05,5.15 123.7,5.15 123.35,5.15 124.4,6.85 124.75,6.85 125.1,6.85 124.05,6.85 123.7,6.85 123.35,6.85 130.85,12.9 130.85,13.25 130.85,13.6 130.85,12.55 130.85,12.2 130.85,11.85 129.15,12.9 129.15,13.25 129.15,13.6 129.15,12.55 129.15,12.2 129.15,11.85 130.85,34.4 130.85,34.75 130.85,35.1 130.85,34.05 130.85,33.7 130.85,33.35 129.15,34.4 129.15,34.75 129.15,35.1 129.15,34.05 129.15,33.7 129.15,33.35 130.85,54.4 130.85,54.75 130.85,55.1 130.85,54.05 130.85,53.7 130.85,53.35 129.15,54.4 129.15,54.75 129.15,55.1 129.15,54.05 129.15,53.7 129.15,53.35 130.85,80.4 130.85,80.75 130.85,81.1 130.85,80.05 130.85,79.7 130.85,79.35 129.15,80.4 129.15,80.75 129.15,81.1 129.15,80.05 129.15,79.7 129.15,79.35 121.6,89.85 121.25,89.85 120.9,89.85 121.95,89.85 122.3,89.85 122.65,89.85 121.6,88.15 121.25,88.15 120.9,88.15 121.95,88.15 122.3,88.15 122.65,88.15 109.1,89.85 108.75,89.85 108.4,89.85 109.45,89.85 109.8,89.85 110.15,89.85 109.1,88.15 108.75,88.15 108.4,88.15 109.45,88.15 109.8,88.15 110.15,88.15 94.1,96.85 93.75,96.85 93.4,96.85 94.45,96.85 94.8,96.85 95.15,96.85 94.1,95.15 93.75,95.15 93.4,95.15 94.45,95.15 94.8,95.15 95.15,95.15 75.6,96.85 75.25,96.85 74.9,96.85 75.95,96.85 76.3,96.85 76.65,96.85 75.6,95.15 75.25,95.15 74.9,95.15 75.95,95.15 76.3,95.15 76.65,95.15 60.1,96.85 59.75,96.85 59.4,96.85 60.45,96.85 60.8,96.85 61.15,96.85 60.1,95.15 59.75,95.15 59.4,95.15 60.45,95.15 60.8,95.15 61.15,95.15 14.6,96.85 14.25,96.85 13.9,96.85 14.95,96.85 15.3,96.85 15.65,96.85 14.6,95.15 14.25,95.15 13.9,95.15 14.95,95.15 15.3,95.15 15.65,95.15

### Footprints (pad centres in the part's own frame; a part is rotated, then mirrored left to right if it is on the bottom)
C0603 = smd 1.1 x 1: 1 -0.85,0; 2 0.85,0
NTE = smd 1.067 x 2.184: 1 -3.81,-4.85; 3 -1.27,-4.85; 5 1.27,-4.85; 7 3.81,-4.85; 8 3.81,4.85; 10 1.27,4.85; 12 -1.27,4.85; 14 -3.81,4.85
RKJXT1F = drill 1: A -1.5,-7.8; B 7.8,-1.5; C 1.5,7.8; COM -1,5.78; D -7.8,1.5; ENCODERA -7.8,-1.5; ENCODERB 7.8,1.5; ENCODERCOM -1.5,7.8; GND 6.86,-3.75; LUG -3.8,-1.5; PUSH 1,-6.98
7395-02 = drill 1.016 long: 1 1.27,0; 2 -1.27,0
7395-03 = drill 1.016 long: 1 2.54,0; 2 0,0; 3 -2.54,0
7395-05 = drill 1.016 long: 1 5.08,0; 2 2.54,0; 3 0,0; 4 -2.54,0; 5 -5.08,0
FIDUCIAL-1X2 = smd 1 x 1: 1 0,0
8200 = smd 3.05 x 1.52: 1 0,1.145; 2 0,-1.145
CONNECTOR = drill 1 pad 1.6 offset: 1 -33.5,0; 2 -30.96,0; 3 -28.42,0; 4 -25.88,0; 5 -23.34,0; 6 -20.8,0; 7 -18.26,0; 8 -15.72,0; 9 -13.18,0; 10 -10.64,0; 11 -8.1,0; 12 -5.56,0; 13 -3.02,0; 14 -0.48,0; 15 2.06,0; 16 4.6,0 | drill 2.7 pad 4.5: 33 -41,0; 36 41,0
CHIP-LED0603 = smd 0.8 x 0.8: A 0,-0.75; C 0,0.75
P2.5 = drill 2.7 pad 5: 1 0,0
SOIC08 = smd 0.66 x 2.032: 1 -1.905,-3.073; 2 -0.635,-3.073; 3 0.635,-3.073; 4 1.905,-3.073; 5 1.905,3.073; 6 0.635,3.073; 7 -0.635,3.073; 8 -1.905,3.073
R0603 = smd 1 x 1.1: 1 -0.85,0; 2 0.85,0
SJ = smd 1.168 x 1.6: 1 -0.762,0; 2 0.762,0
SOT−23 = smd 0.787 x 0.889: 1 0.94,1.003; 2 -0.94,1.003; 3 0,-1.003
S8 = smd 0.762 x 1.143: 1 -1.905,-2.603; 2 -0.635,-2.603; 3 0.635,-2.603; 4 1.905,-2.603; 5 1.905,2.603; 6 0.635,2.603; 7 -0.635,2.603; 8 -1.905,2.603
SOT95P280X145-6N = smd 1.27 x 0.559: 1 -1.295,0.94; 2 -1.295,0; 3 -1.295,-0.94; 4 1.295,-0.94; 5 1.295,0; 6 1.295,0.94
SOT163-1 = smd 0.6 x 1.5: 1 -5.715,-4.75; 2 -4.445,-4.75; 3 -3.175,-4.75; 4 -1.905,-4.75; 5 -0.635,-4.75; 6 0.635,-4.75; 7 1.905,-4.75; 8 3.175,-4.75; 9 4.445,-4.75; 10 5.715,-4.75; 11 5.715,4.75; 12 4.445,4.75; 13 3.175,4.75; 14 1.905,4.75; 15 0.635,4.75; 16 -0.635,4.75; 17 -1.905,4.75; 18 -3.175,4.75; 19 -4.445,4.75; 20 -5.715,4.75
MOLEX_90814-0210 = smd 1.194 x 2.007: 1 0,0; 2 1.27,5.994; 3 2.54,0; 4 3.81,5.994; 5 5.08,0; 6 6.35,5.994; 7 7.62,0; 8 8.89,5.994; 9 10.16,0; 10 11.43,5.994 | hole 1.753: -1.93,1.092; 13.36,1.092
MK_CUSTOM = smd 1.75 x 3.5: 1 -25.4,15.24; 2 -22.86,15.24; 3 -20.32,15.24; 4 -17.78,15.24; 5 -15.24,15.24; 6 -12.7,15.24; 7 -10.16,15.24; 8 -7.62,15.24; 9 -5.08,15.24; 10 -2.54,15.24; 11 0,15.24; 12 2.54,15.24; 13 5.08,15.24; 14 7.62,15.24; 15 10.16,15.24; 16 12.7,15.24; 17 15.24,15.24; 18 17.78,15.24; 19 20.32,15.24; 20 22.86,15.24; 21 25.4,15.24; 22 25.4,-15.24; 23 22.86,-15.24; 24 20.32,-15.24; 25 17.78,-15.24; 26 15.24,-15.24; 27 12.7,-15.24; 28 10.16,-15.24; 29 7.62,-15.24; 30 5.08,-15.24; 31 2.54,-15.24; 32 0,-15.24; 33 -2.54,-15.24; 34 -5.08,-15.24; 35 -7.62,-15.24; 36 -10.16,-15.24; 37 -12.7,-15.24; 38 -15.24,-15.24; 39 -17.78,-15.24; 40 -20.32,-15.24; 41 -22.86,-15.24; 42 -25.4,-15.24
EC20A = drill 1.2: A -6.25,-9; B -1.25,-10; C -3.75,-10; D -2.5,-7; E 2.5,-7
NC5MAV-SW = drill 1.2: 1 -4.445,0.635; 3 0,-4.445; 5 3.81,1.27; G 0,-8.225; N -8.89,0; NC -6.985,-0.635; NO -10.795,0.635 | drill 1.6: 2 -3.175,-2.54; 4 3.175,-2.54

### Placement (x,y rotation side)
C1  52.65,38.25 0 top
C2  62.15,17.7 90 top
C3  63.35,17.7 90 top
C4  94.25,76.25 180 bottom
C5  91.24,90.7 180 bottom
C6  95.74,88.08 180 bottom
C7  29.48,26.96 90 top
C8  32.85,22.56 270 top
C9  84.09,86.92 0 top
C10  88.64,83.04 90 bottom
C11  24.2,81.7 0 top
C12  18.2,81.7 180 top
C13  35.27,81.7 0 top
C14  29.98,81.7 180 top
C15  18.45,78.7 90 top
C16  29.7,78.7 90 top
DC1  57.15,24.75 90 top
ENC1  115.5,60.4 0 top
J1  24.5,90 180 top
J2  18.5,90 180 top
J3  31.5,90 180 top
J4  48.75,90 180 top
J5  57,90 180 top
J6  13.2,18 270 top
J7  13,39 270 top
J9  13.2,27 270 top
JP1  16,9 0 top
JP2  16,93 0 top
JP3  126,9 0 top
JP4  126,85 0 top
L1  52.9,34.75 180 top
LCD1  72.5,51 270 top
LED5  39.35,90.75 90 top
LED6  92.5,73 270 top
LED7  92.5,58 270 top
LED8  92.5,42 270 top
LED9  92.5,28 270 top
MP1  10,10 0 top
MP2  10,92 0 top
MP3  65,10 0 top
MP4  65,92 0 top
MP5  105.5,70.4 0 top
MP6  105.3,50.4 0 top
MP7  125.4,50.4 0 top
MP8  125.5,70.4 0 top
OK1  36.6,24.75 180 top
OK2  25.77,24.75 0 top
R1  94.25,74.45 0 bottom
R2  89.95,78.86 270 bottom
R3  96.52,84.11 270 bottom
R4  88.83,86.61 270 bottom
R5  88.89,89.86 270 bottom
R6  76.97,71.59 90 top
R7  36.7,84.7 270 top
R8  28.7,84.7 270 top
R9  25.2,84.7 270 top
R10  17.2,84.7 270 top
R11  113.1,45.65 270 top
R12  120.6,45.65 270 top
R13  118.1,45.65 270 top
R14  23.2,84.7 270 top
R15  19.2,84.7 270 top
R16  34.2,84.7 270 top
R17  31.2,84.7 270 top
R18  110.6,45.65 270 top
R19  115.6,45.65 270 top
R20  108.1,45.65 270 top
R21  42.6,90.75 0 top
R22  123.1,45.65 270 top
R23  25.25,12.71 270 top
R24  37.5,11.75 90 top
R25  78.8,71.59 90 top
R26  80.62,71.59 90 top
R27  25.13,36.2 90 top
R29  82.45,71.59 90 top
R30  82.45,47.41 270 top
R31  80.62,47.41 270 top
R40  24.23,31.5 0 top
R41  25.25,18.75 90 top
R42  38.5,34 90 top
R43  34.75,34 90 top
R44  78.8,47.41 270 top
R45  76.97,47.41 270 top
R46  78.66,90.4 180 top
R47  81.84,90.4 0 top
R48  92.5,71 0 top
R49  92.5,56 0 top
R50  92.5,40 0 top
R51  92.5,26 0 top
SJ5  115.5,27.7 270 bottom
T1  92.49,78.64 180 bottom
U1  92.92,83.71 0 bottom
U2  32.53,78.7 270 top
U3  21.2,78.7 270 top
U4  83.92,80.08 0 top
U5  76.42,17.56 90 bottom
U6  57,34.56 90 bottom
U8  40.35,68.8 0 bottom
U$1  44.7,62.3 0 top
U$2  115.5,60.4 315 top
U$3  109.9,84.3 0 top
U$4  116,77 0 top
U$5  86,37 90 top
U$6  39.23,69.34 0 top
U$7  81.9,25.2 90 top
X1  12.4,60.5 270 top
X2  121.6,79 0 bottom
X6  115.5,27.7 0 top
X7  109.59,15.28 180 bottom
X8  42.05,11.53 90 bottom

### Tracks (layer width: path | path; a pad name or v marks a point on that pad's centre or on a via)
+3V3  (via drill 0.5)  (2 unrouted)
  Top 0.406: v63,33 63,56.3 v62.5,56.8 | v48.1,56.8 v35.9,56.8
  Bottom 0.406: U5.2 97.33,18.83 98.5,20 | U6.2 v62.99,33.01 v63,33 | v62.5,56.8 v48.1,56.8 | v35.9,56.8 15.5,56.8
  other vias: 15.3,80 14.3,80 14.3,79 15.3,79 83.3,91.7 77,93.5 78,93.5
  pour Top: 84,83 84,95 69,95 69,91 75.5,91 75.5,83
  pour Top: 6,73 6,92 arc-90 10,96 39,96 39,73
  pour Bottom: 13.3,87.5 16.2,87.5 16.2,50.5 13.3,50.5
  pour Bottom: 69,96 69,91 98.5,91 98.5,20 80,20 80,18 101,18 101.09,92 arc90 97.09,96
+5V  (via drill 0.5, 0.55)  (1 unrouted)
  Bottom 0.406: X7.8 118.5,9.3 v118.5,11.7 | X8.8 48.13,20.5 v45.25,20.5
  pour Top: 101,42 101,6 126,6 arc90 130,10 130,42
  pour Top (isolate 0.305): 22,24.75 69,24.75 69,6 22,6
+5V/1  (via drill 0.5)  (2 unrouted)
  Bottom 0.406: X2.1 121.6,77.7 v122.6,76.7 | U5.1 79.14,17.56 v79.7,17 | C6.1 94.83,88.03 | 94.83,88.03 U1.8 | R2.2 89.95,77.05 v90.75,76.25 | U6.1 59.46,34.56 v59.5,34.6 | 94.83,88.03 93.72,88.03 v93.15,88.6 | U8.42 65.75,51.75 v64,50
  pour Top (rank 3): 137,-1 137,103 -1,103 -1,-1
D0  (via drill 0.35)
  Top 0.178: R6.1 76.8,70.58 v76.8,69.26 | U4.1 78.25,75.28 v78.25,74
  Bottom 0.178: LCD1.7 v76.8,69.26 78.25,70.71 v78.25,74
D1  (via drill 0.35)
  Top 0.178: v77.55,66.72 78.8,67.97 R25.1 | U4.2 79.5,75.31 v79.5,74
  Bottom 0.178: LCD1.8 v77.55,66.72 79.5,68.67 v79.5,74
D2  (via drill 0.35)
  Top 0.178: U4.3 v80.75,74 | v78.55,64.18 80.62,66.25 R26.1
  Bottom 0.178: LCD1.9 v78.55,64.18 80.75,66.38 v80.75,74
D3  (via drill 0.35)
  Top 0.178: U4.4 82.02,74.02 v82,74 | v79.3,61.64 82.45,64.8 R29.1
  Bottom 0.178: LCD1.10 v79.3,61.64 82,64.34 v82,74
D4  (via drill 0.35, 0.5)
  Top 0.178: R30.1 v82.45,59.16 | U4.5 83.25,75.3 v83.25,74
  Bottom 0.178: LCD1.11 82.4,59.1 v82.45,59.16 83.25,59.95 v83.25,74
D5  (via drill 0.35)
  Top 0.178: R31.1 80.55,48.34 80.55,56.5 v80.5,56.55 | U4.6 84.5,75.28 v84.5,74
  Bottom 0.178: LCD1.12 80.48,56.56 arc-45 v80.5,56.55 83.05,56.55 84.5,58 v84.5,74
D6  (via drill 0.35)
  Top 0.178: R44.1 v78.8,54 | U4.7 85.75,75.25 v85.75,74
  Bottom 0.178: LCD1.13 78.75,54.02 arc-45 v78.8,54 84.75,54 85.75,55 v85.75,74
D7  (via drill 0.35)
  Top 0.178: R45.1 76.97,51.47 v76.98,51.48 | U4.8 87,75.23 v87,74
  Bottom 0.178: LCD1.14 v76.98,51.48 85.48,51.48 87,53 v87,74
DIR_A  (via drill 0.35)  (1 unrouted)
  Top 0.178: v115.8,66.9 115.8,58.6 114,56.8 ENC1.A 114,47.4 R11.1 | X1.6 23.15,54.15 26,57 v26,66.2
  Bottom 0.178: v115.8,66.9 115.25,67.45 X2.6 | v26,66.2 32,66.2 40.35,74.55 U8.11
DIR_B  (via drill 0.35)  (1 unrouted)
  Top 0.178: 122.1,58.9 120,56.8 120,53 120.6,52.4 R12.1 | 122.1,58.9 ENC1.B | v114.1,71.7 v121.5,71.7 121.6,71.7 | X1.7 12.52,53 25,53 28,56 v28,64.2 | 122.1,58.9 121.8,59.2 v121.8,65.9
  Bottom 0.178: v114.1,71.7 114.1,78.88 X2.7 | v28,64.2 33,64.2 42.89,74.09 U8.10 | v121.8,65.9 121.8,71.4 v121.5,71.7
DIR_C  (via drill 0.35)  (1 unrouted)
  Top 0.178: v112.85,70.7 116.5,70.7 117,70.2 ENC1.C 118.1,67.1 R13.1 | X1.8 25.61,51.61 30,56 v30,62.2
  Bottom 0.178: v112.85,70.7 112.71,70.84 X2.8 | v30,62.2 34,62.2 45.43,73.63 U8.9
DIR_D  (via drill 0.35)  (1 unrouted)
  Top 0.178: R18.1 110,47.1 110,59.6 ENC1.D | X1.9 27.34,50.34 32,55 v32,60.2
  Bottom 0.178: v32,60.2 35,60.2 47.97,73.17 U8.8 | ENC1.D 107.7,63.7 111.44,67.44 X2.9
DIRECTION_1  (via drill 0.35)
  Top 0.178: U2.6 33.47,76.47 31,74 v27,74
  Bottom 0.178: v27,74 25.11,75.89 U8.17
DIRECTION_2  (via drill 0.35)
  Top 0.178: U2.4 31.59,76.59 31,76 v28,76
  Bottom 0.178: v28,76 27.65,76.35 U8.16
ENCODER_A  (via drill 0.35)  (1 unrouted)
  Top 0.178: v110.1,72.95 119.75,72.95 120.7,73.9 120.7,75.4 120.33,75.77 v120.33,82 | R20.1 109,47.4 109,55 108.02,55.98 U$2.C 105.78,56.98 ENC1.ENCODERA | X1.2 21.23,59.23 22,60 v22,70.2
  Bottom 0.178: ENC1.ENCODERA 106,60.6 106,65.8 110.1,69.9 v110.1,72.95 | v22,70.2 31,70.2 35.27,74.47 U8.13 | X2.2 v120.33,82
ENCODER_B  (via drill 0.35)  (1 unrouted)
  Top 0.178: v122.85,66.95 v120.1,66.95 | X1.3 13.96,57.96 16,60 v16,72.2 | R22.1 123.1,47.4 v121.7,48.8 | v119.2,61 v119.2,51.3
  Bottom 0.178: 119.1,78.96 X2.3 119.06,77.74 119.4,77.4 119.4,67.65 v120.1,66.95 | v16,72.2 31,72.2 32.73,73.93 U8.14 | v119.2,61 120.1,61.9 ENC1.ENCODERB 123.3,66.5 v122.85,66.95 | v121.7,48.8 v119.2,51.3 110.46,51.3 U$2.B
ESW3_RX  (via drill 0.35)
  Top 0.178: OK1.7 37.23,15.52 v40,12.75 37.65,12.75 R24.2
  Bottom 0.178: X8.2 48,12.75 v40,12.75
ESW3_RX_ISO  (via drill 0.35)
  Top 0.178: R42.2 38.5,39.5 v33.5,44.5
  Bottom 0.178: v33.5,44.5 30.25,47.75 30.25,53.5 U8.28
ESW3_TOR  (via drill 0.35)
  Top 0.178: v36,18.25 35.97,18.29 OK1.6
  Bottom 0.178: X8.6 36.38,17.88 v36,18.25
ESW3_TOR_ISO  (via drill 0.35)
  Top 0.178: v39.5,47 43.25,47 v45.5,49.25 | R43.2 34.75,36.15 v36.5,37.9
  Bottom 0.178: v45.5,49.25 45.5,53.49 U8.34 | v36.5,37.9 39.5,40.9 v39.5,47
ESW3_TX  (via drill 0.35)
  Top 0.178: R41.1 v25.25,15.75 R23.1
  Bottom 0.178: X8.4 25.66,15.34 v25.25,15.75
ESW3_TX_ISO  (via drill 0.35)
  Top 0.178: v32.5,49.25 25.13,41.88 R27.2
  Bottom 0.178: v32.5,49.25 32.5,53.33 U8.29
GND  (via drill 0.5)  (1 unrouted)
  Top 0.406: v32.75,20.25 32.75,21.6 C8.2 32.91,21.65 32.94,21.68 OK1.5 | OK2.3 26.41,20.59 v26.75,20.25 | R23.2 26.89,11.86 v27,11.75 | v64.7,18.55 C3.2 C2.2 62,18.7 DC1.1
  pour Bottom: 101,6 126,6 arc90 130,10 130,42 101,42
  pour Bottom (isolate 0.305): 22,24.75 22,6 69,6 69,24.75
GND1  (via drill 0.5)  (3 unrouted)
  Top 0.406: v64.15,28.5 62.06,28.5 DC1.7 | C1.2 v55.15,38.25 | LED5.C v37.1,90.75 | v76.3,36.4 76.36,36.34 | LED6.C v95.2,73 | LED7.C v95.1,58 | LED8.C v95.05,42 | LED9.C v95.25,28 | U4.10 89.64,74.14 v88.5,73 | X1.10 16.43,49.07 v16.4,49.1 | X1.5 10.42,55.42 v10.4,55.4 | C11.2 C14.2 29.7,81.13 C16.2 30.55,78.7 v31.7,78.7 32.2,78.7 32.53,79.03 U2.2 32.53,79.53 | C13.2 36.5,81.32 v36.5,79.6 | C12.2 17.1,81.45 v17.1,80.3 17.85,79.55 C15.2 | U3.2 v21.2,81.4 | OK2.5 C7.2 29.48,29.48 v29.5,29.5 | OK1.2 37.23,30.07 v37.2,30.1
  other vias: 87.2,86.8
  pour Bottom (isolate 0.254, rank 3): -1,103 -1,-1 137,-1 137,103
  pour Top (rank 2): 84,88.8 92,88.8 92,83 84,83
JOGWHEEL_1
  Bottom 0.178: J9.2 16,27 30,41 34,41 35.27,42.27 U8.30
JOGWHEEL_2
  Bottom 0.178: J6.2 16,18 17,19 17,26 30,39 36,39 37.81,40.81 U8.31
LED_1
  Bottom 0.178: 53.05,84.7 U8.6 53.05,88.24 J4.3
LED_2
  Bottom 0.178: J5.3 59.54,88.54 58,87 57,87 55.59,85.59 U8.5
LED_STATUS_1  (via drill 0.35)  (1 unrouted)
  Top 0.178: v87.5,29.75 87.5,68.25 88.75,69.5 92.25,69.5 93.35,70.6 R48.2 | v58.75,58.25 60,57 v60,47
  Bottom 0.178: U5.10 86.74,28.99 v87.5,29.75 | U8.4 58.13,58.87 v58.75,58.25 | v60,47 61.01,45.99 U6.10
LED_STATUS_2  (via drill 0.35)  (1 unrouted)
  Top 0.178: v88.75,27 88.75,53.25 90,54.5 92.5,54.5 93.35,55.35 R49.2 | v61,57.75 v61,43.5
  Bottom 0.178: U5.8 88.2,26.45 v88.75,27 | U8.3 60.67,58.08 v61,57.75 | v61,43.5 62.94,43.5 U6.8
LED_STATUS_3  (via drill 0.35)  (1 unrouted)
  Top 0.178: v90.25,24.75 90.25,38 90.75,38.5 92.75,38.5 93.35,39.1 R50.2 | v64.1,57.15 64.75,56.5 v64.75,41
  Bottom 0.178: U5.6 89.41,23.91 v90.25,24.75 | U8.2 63.21,58.04 v64.1,57.15 | v64.75,41 64.66,40.91 U6.6
LED_STATUS_4  (via drill 0.35)  (1 unrouted)
  Top 0.178: v93,22 93.35,22.35 R51.2 | v65.75,57.75 65.75,38.75 v65.5,38.5
  Bottom 0.178: U5.4 92.37,21.37 v93,22 | U8.1 v65.75,57.75 | v65.5,38.5 65.37,38.37 U6.4
N$1
  Top 0.406: DC1.8 52.3,29.9 52.9,30.5 L1.1
N$2
  Bottom 0.178: R1.2 C4.1 93.43,76.28 T1.1
N$3
  Bottom 0.178: 92.49,81.48 92.49,81 | 92.49,81 T1.3 92.42,79.71 R2.1 | U1.3 92.4,81 92.49,81
N$4
  Top 0.178: R48.1 91.65,72.9 LED6.A
N$5
  Bottom 0.178: U1.2 U1.1 95.61,81.11 96.52,82.02 R3.2
N$6
  Top 0.178: R15.1 R10.1 17.23,85.58 J2.1
N$7
  Top 0.178: R9.1 R14.1 23.2,89.97 J1.1
N$8  (via drill 0.35)
  Top 0.178: R7.1 R16.1 v34.2,87.45 | J3.1 28.96,87.49 v29,87.45
  Bottom 0.178: v29,87.45 v34.2,87.45
N$9
  Top 0.178: R8.1 R17.1 31.5,85.85 J3.2
N$10
  Top 0.178: R16.2 34.42,83.63 C13.1 33.95,81.7 33.47,81.22 U2.1
N$11
  Top 0.178: R17.2 31.2,82.07 C14.1 31.3,81.7 31.59,81.41 U2.3
N$12
  Top 0.178: R15.2 19.05,83.7 C12.1 20.05,81.7 20.25,81.5 U3.3 20.26,80.14
N$13
  Top 0.178: U3.1 22.14,81.14 22.7,81.7 C11.1 23.2,81.85 R14.2
N$14
  Bottom 0.178: R4.2 89.46,85.76 89.9,86.2 89.9,86.95 90.1,87.15 92.1,87.15 92.29,86.96 U1.6 92.29,85.31 92.9,84.7 96.25,84.7 R3.1
N$15
  Top 0.178: R27.1 25.13,31.55 R40.2 25.08,27.82 OK2.7
N$17
  Bottom 0.178: R5.2 88.83,88.95 R4.1 88.97,87.6 93,87.6 93.56,87.04 U1.7
N$22
  Top 0.178: R49.1 91.65,57.9 LED7.A
N$23
  Bottom 0.178: X6.G 117,20.98 117,24.2 115.5,25.7 SJ5.2
N$24
  Top 0.178: R50.1 91.65,41.9 LED8.A
N$29
  Top 0.178: R51.1 91.65,27.9 LED9.A
N$35
  Top 0.178: LED5.A R21.1
N$37
  Top 0.178: OK1.1 R42.1
N$38
  Top 0.178: OK1.4 34.75,27.88 R43.1
N$39
  Top 0.178: R41.2 25.25,21.57 OK2.2
PUSH  (via drill 0.35)  (1 unrouted)
  Top 0.178: v116.5,65.85 ENC1.PUSH 116.5,50.6 115.6,49.7 R19.1 | X1.4 21.69,56.69 24,59 v24,68.2
  Bottom 0.178: v116.5,65.85 118.05,67.4 118.05,74.23 117.79,74.49 X2.4 | v24,68.2 31,68.2 37.81,75.01 U8.12 | U$2.E 113.04,54.4 115.52,54.4 ENC1.PUSH
PUSH_BUTTON_1  (via drill 0.35)
  Top 0.178: U3.6 22.14,78.64 v22.25,78.75
  Bottom 0.178: v22.25,78.75 22.57,79.07 U8.18
PUSH_BUTTON_2  (via drill 0.35)
  Top 0.178: v20.25,78.75 20.25,77.42 U3.4
  Bottom 0.178: U8.19 20.03,78.97 v20.25,78.75
PWM_CONTRASTE  (via drill 0.35)  (1 unrouted)
  Top 0.178: v96,31 96.16,31.16 v96.16,74.45
  Bottom 0.178: U5.9 78.72,27.72 79,28 79,29 81,31 v96,31 | R1.1 v96.16,74.45 | U8.35 48,53.53 48,50 53.28,44.72 U6.9
RX
  Bottom 0.178: X7.2 110.86,18.06 112.33,19.52 X6.2
SCL  (via drill 0.35)  (1 unrouted)
  Top 0.178: R47.1 | R47.1 80.75,90.16 U4.18 | v96,23 97.25,24.25 97.25,92.25 96.25,93.25 83.59,93.25 80.99,90.65 R47.1
  Bottom 0.178: v96,23 95.64,22.64 U5.5 | U6.5 52.36,39.64 42.89,49.11 U8.33
SDA  (via drill 0.35)  (1 unrouted)
  Top 0.178: R46.1 | R46.1 79.47,90.36 U4.19 | v97,20.5 98.25,21.75 98.25,92.25 96.25,94.25 83.25,94.25 79.51,90.51 R46.1
  Bottom 0.178: v97,20.5 96.6,20.1 U5.3 | U6.3 51.9,37.1 40.35,48.65 U8.32
TOR
  Bottom 0.178: X7.6 115.94,17.39 118.67,20.12 X6.4
TX
  Bottom 0.178: X7.4 113.5,9.38 113.5,19.45 115.5,21.45 X6.3
VEE
  Bottom 0.178: U1.4 89.72,81.11 C10.1
  Bottom 0.406: LCD1.15 86.94,48.94 90,52 90,75.52 88.64,76.89 C10.1
VO
  Bottom 0.178: LCD1.3 75.67,79.42 76.75,80.5 76.75,89.5 77.97,90.72 R5.1 C5.1
  Bottom 0.406: C5.1
WHEEL_0_LED_1
  Bottom 0.178: J7.1 19.92,33.92 27.65,41.65 U8.27
WHEEL_0_LED_2
  Bottom 0.178: J7.2 18.46,36.46 25.11,43.11 U8.26
WHEEL_1_LED_1
  Bottom 0.178: J7.3 18,39 22.57,43.57 U8.25
WHEEL_1_LED_2
  Bottom 0.178: J7.4 16.54,41.54 20,45 20,53.53 U8.24

### Text on the board
tPlace: Varmo Rev A2 | Varmo Rev A2 | Varmo Rev A2